# Altium schematic sheet Sheet1.SchDoc: Display
size B; Date: 10/02/2023; DrawnBy: NVK; SheetNumber: 1; SheetTotal: 1
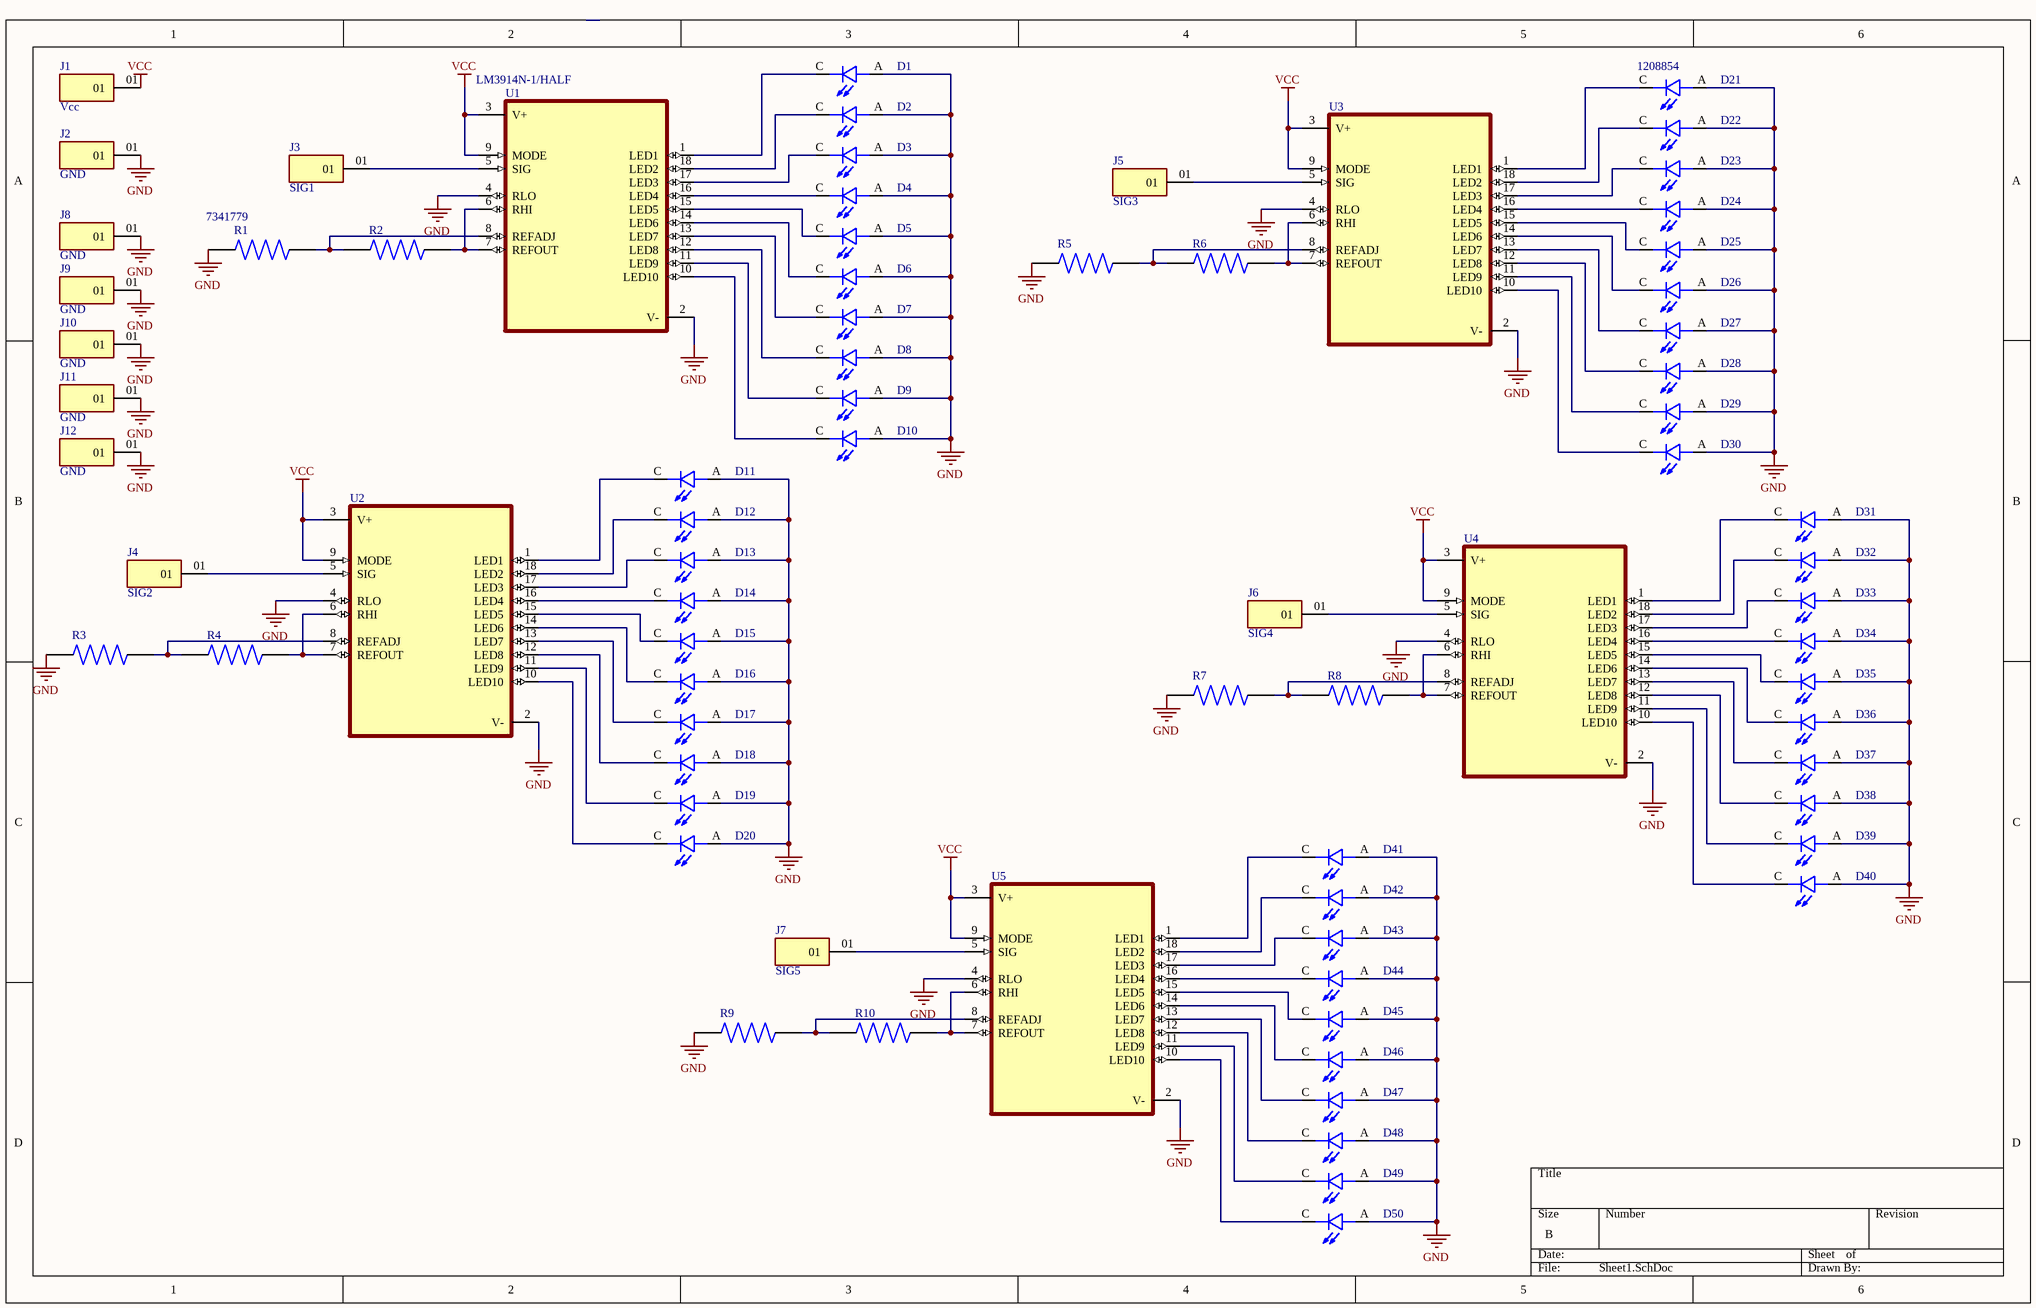
[diagram p0: Sheet1.SchDoc]

## Parts
D1  L08R5000Q1  [LEDRD254W57D500H1070]  (value not drawn)
D2  L08R5000Q1  [LEDRD254W57D500H1070]  (value not drawn)
D3  L08R5000Q1  [LEDRD254W57D500H1070]  (value not drawn)
D4  L08R5000Q1  [LEDRD254W57D500H1070]  (value not drawn)
D5  L08R5000Q1  [LEDRD254W57D500H1070]  (value not drawn)
D6  L08R5000Q1  [LEDRD254W57D500H1070]  (value not drawn)
D7  L08R5000Q1  [LEDRD254W57D500H1070]  (value not drawn)
D8  L08R5000Q1  [LEDRD254W57D500H1070]  (value not drawn)
D9  L08R5000Q1  [LEDRD254W57D500H1070]  (value not drawn)
D10  L08R5000Q1  [LEDRD254W57D500H1070]  (value not drawn)
D11  L08R5000Q1  [LEDRD254W57D500H1070]  (value not drawn)
D12  L08R5000Q1  [LEDRD254W57D500H1070]  (value not drawn)
D13  L08R5000Q1  [LEDRD254W57D500H1070]  (value not drawn)
D14  L08R5000Q1  [LEDRD254W57D500H1070]  (value not drawn)
D15  L08R5000Q1  [LEDRD254W57D500H1070]  (value not drawn)
D16  L08R5000Q1  [LEDRD254W57D500H1070]  (value not drawn)
D17  L08R5000Q1  [LEDRD254W57D500H1070]  (value not drawn)
D18  L08R5000Q1  [LEDRD254W57D500H1070]  (value not drawn)
D19  L08R5000Q1  [LEDRD254W57D500H1070]  (value not drawn)
D20  L08R5000Q1  [LEDRD254W57D500H1070]  (value not drawn)
D21  Supplier Part Number 1: 1208854  [LEDRD254W57D500H1070]  (hidden comment: L08R5000Q1)
D22  L08R5000Q1  [LEDRD254W57D500H1070]  (value not drawn)
D23  L08R5000Q1  [LEDRD254W57D500H1070]  (value not drawn)
D24  L08R5000Q1  [LEDRD254W57D500H1070]  (value not drawn)
D25  L08R5000Q1  [LEDRD254W57D500H1070]  (value not drawn)
D26  L08R5000Q1  [LEDRD254W57D500H1070]  (value not drawn)
D27  L08R5000Q1  [LEDRD254W57D500H1070]  (value not drawn)
D28  L08R5000Q1  [LEDRD254W57D500H1070]  (value not drawn)
D29  L08R5000Q1  [LEDRD254W57D500H1070]  (value not drawn)
D30  L08R5000Q1  [LEDRD254W57D500H1070]  (value not drawn)
D31  L08R5000Q1  [LEDRD254W57D500H1070]  (value not drawn)
D32  L08R5000Q1  [LEDRD254W57D500H1070]  (value not drawn)
D33  L08R5000Q1  [LEDRD254W57D500H1070]  (value not drawn)
D34  L08R5000Q1  [LEDRD254W57D500H1070]  (value not drawn)
D35  L08R5000Q1  [LEDRD254W57D500H1070]  (value not drawn)
D36  L08R5000Q1  [LEDRD254W57D500H1070]  (value not drawn)
D37  L08R5000Q1  [LEDRD254W57D500H1070]  (value not drawn)
D38  L08R5000Q1  [LEDRD254W57D500H1070]  (value not drawn)
D39  L08R5000Q1  [LEDRD254W57D500H1070]  (value not drawn)
D40  L08R5000Q1  [LEDRD254W57D500H1070]  (value not drawn)
D41  L08R5000Q1  [LEDRD254W57D500H1070]  (value not drawn)
D42  L08R5000Q1  [LEDRD254W57D500H1070]  (value not drawn)
D43  L08R5000Q1  [LEDRD254W57D500H1070]  (value not drawn)
D44  L08R5000Q1  [LEDRD254W57D500H1070]  (value not drawn)
D45  L08R5000Q1  [LEDRD254W57D500H1070]  (value not drawn)
D46  L08R5000Q1  [LEDRD254W57D500H1070]  (value not drawn)
D47  L08R5000Q1  [LEDRD254W57D500H1070]  (value not drawn)
D48  L08R5000Q1  [LEDRD254W57D500H1070]  (value not drawn)
D49  L08R5000Q1  [LEDRD254W57D500H1070]  (value not drawn)
D50  L08R5000Q1  [LEDRD254W57D500H1070]  (value not drawn)
J1  Vcc  [SAMTEC_MTMM-101-XX-X-S-XXX]
J2  GND  [SAMTEC_MTMM-101-XX-X-S-XXX]
J3  SIG1  [SAMTEC_MTMM-101-XX-X-S-XXX]
J4  SIG2  [SAMTEC_MTMM-101-XX-X-S-XXX]
J5  SIG3  [SAMTEC_MTMM-101-XX-X-S-XXX]
J6  SIG4  [SAMTEC_MTMM-101-XX-X-S-XXX]
J7  SIG5  [SAMTEC_MTMM-101-XX-X-S-XXX]
J8  GND  [SAMTEC_MTMM-101-XX-X-S-XXX]
J9  GND  [SAMTEC_MTMM-101-XX-X-S-XXX]
J10  GND  [SAMTEC_MTMM-101-XX-X-S-XXX]
J11  GND  [SAMTEC_MTMM-101-XX-X-S-XXX]
J12  GND  [SAMTEC_MTMM-101-XX-X-S-XXX]
R1  Supplier Part Number 1: 7341779  [RESAD1100W55L680D260]  (hidden comment: MFR-25FBF52-1K)
R2  MFR-25FBF52-1K  [RESAD1100W55L680D260]  (value not drawn)
R3  MFR-25FBF52-1K  [RESAD1100W55L680D260]  (value not drawn)
R4  MFR-25FBF52-1K  [RESAD1100W55L680D260]  (value not drawn)
R5  MFR-25FBF52-1K  [RESAD1100W55L680D260]  (value not drawn)
R6  MFR-25FBF52-1K  [RESAD1100W55L680D260]  (value not drawn)
R7  MFR-25FBF52-1K  [RESAD1100W55L680D260]  (value not drawn)
R8  MFR-25FBF52-1K  [RESAD1100W55L680D260]  (value not drawn)
R9  MFR-25FBF52-1K  [RESAD1100W55L680D260]  (value not drawn)
R10  MFR-25FBF52-1K  [RESAD1100W55L680D260]  (value not drawn)
U1  Supplier Part Number 1: LM3914N-1/HALF  [DIP952W45P254L2336H533Q18]  (hidden comment: LM3914N-1)
U2  LM3914N-1  [DIP952W45P254L2336H533Q18]  (value not drawn)
U3  LM3914N-1  [DIP952W45P254L2336H533Q18]  (value not drawn)
U4  LM3914N-1  [DIP952W45P254L2336H533Q18]  (value not drawn)
U5  LM3914N-1  [DIP952W45P254L2336H533Q18]  (value not drawn)

## Nets
GND: D1.A D2.A D3.A D4.A D5.A D6.A D7.A D8.A D9.A D10.A D11.A D12.A D13.A D14.A D15.A D16.A D17.A D18.A D19.A D20.A D21.A D22.A D23.A D24.A D25.A D26.A D27.A D28.A D29.A D30.A D31.A D32.A D33.A D34.A D35.A D36.A D37.A D38.A D39.A D40.A D41.A D42.A D43.A D44.A D45.A D46.A D47.A D48.A D49.A D50.A J2.01 J8.01 J9.01 J10.01 J11.01 J12.01 R1.1 R3.1 R5.1 R7.1 R9.1 U1.2(V-) U1.4(RLO) U2.2(V-) U2.4(RLO) U3.2(V-) U3.4(RLO) U4.2(V-) U4.4(RLO) U5.2(V-) U5.4(RLO)
VCC: J1.01 U1.3(V+) U1.9(MODE) U2.3(V+) U2.9(MODE) U3.3(V+) U3.9(MODE) U4.3(V+) U4.9(MODE) U5.3(V+) U5.9(MODE)
NetD1_C: D1.C U1.1(LED1)
NetD2_C: D2.C U1.18(LED2)
NetD3_C: D3.C U1.17(LED3)
NetD4_C: D4.C U1.16(LED4)
NetD5_C: D5.C U1.15(LED5)
NetD6_C: D6.C U1.14(LED6)
NetD7_C: D7.C U1.13(LED7)
NetD8_C: D8.C U1.12(LED8)
NetD9_C: D9.C U1.11(LED9)
NetD10_C: D10.C U1.10(LED10)
NetD11_C: D11.C U2.1(LED1)
NetD12_C: D12.C U2.18(LED2)
NetD13_C: D13.C U2.17(LED3)
NetD14_C: D14.C U2.16(LED4)
NetD15_C: D15.C U2.15(LED5)
NetD16_C: D16.C U2.14(LED6)
NetD17_C: D17.C U2.13(LED7)
NetD18_C: D18.C U2.12(LED8)
NetD19_C: D19.C U2.11(LED9)
NetD20_C: D20.C U2.10(LED10)
NetD21_C: D21.C U3.1(LED1)
NetD22_C: D22.C U3.18(LED2)
NetD23_C: D23.C U3.17(LED3)
NetD24_C: D24.C U3.16(LED4)
NetD25_C: D25.C U3.15(LED5)
NetD26_C: D26.C U3.14(LED6)
NetD27_C: D27.C U3.13(LED7)
NetD28_C: D28.C U3.12(LED8)
NetD29_C: D29.C U3.11(LED9)
NetD30_C: D30.C U3.10(LED10)
NetD31_C: D31.C U4.1(LED1)
NetD32_C: D32.C U4.18(LED2)
NetD33_C: D33.C U4.17(LED3)
NetD34_C: D34.C U4.16(LED4)
NetD35_C: D35.C U4.15(LED5)
NetD36_C: D36.C U4.14(LED6)
NetD37_C: D37.C U4.13(LED7)
NetD38_C: D38.C U4.12(LED8)
NetD39_C: D39.C U4.11(LED9)
NetD40_C: D40.C U4.10(LED10)
NetD41_C: D41.C U5.1(LED1)
NetD42_C: D42.C U5.18(LED2)
NetD43_C: D43.C U5.17(LED3)
NetD44_C: D44.C U5.16(LED4)
NetD45_C: D45.C U5.15(LED5)
NetD46_C: D46.C U5.14(LED6)
NetD47_C: D47.C U5.13(LED7)
NetD48_C: D48.C U5.12(LED8)
NetD49_C: D49.C U5.11(LED9)
NetD50_C: D50.C U5.10(LED10)
NetJ3_01: J3.01 U1.5(SIG)
NetJ4_01: J4.01 U2.5(SIG)
NetJ5_01: J5.01 U3.5(SIG)
NetJ6_01: J6.01 U4.5(SIG)
NetJ7_01: J7.01 U5.5(SIG)
NetR1_2: R1.2 R2.1 U1.8(REFADJ)
NetR2_2: R2.2 U1.6(RHI) U1.7(REFOUT)
NetR3_2: R3.2 R4.1 U2.8(REFADJ)
NetR4_2: R4.2 U2.6(RHI) U2.7(REFOUT)
NetR5_2: R5.2 R6.1 U3.8(REFADJ)
NetR6_2: R6.2 U3.6(RHI) U3.7(REFOUT)
NetR7_2: R7.2 R8.1 U4.8(REFADJ)
NetR8_2: R8.2 U4.6(RHI) U4.7(REFOUT)
NetR9_2: R9.2 R10.1 U5.8(REFADJ)
NetR10_2: R10.2 U5.6(RHI) U5.7(REFOUT)

## Library data of the parts
D1-D50 = L08R5000Q1: LED, Orange, Through Hole, T-1 3/4 (5mm), 30 mA, 2.1 V, 635 nm; Price: None; MP: L08R5000Q1; Value: *; Availability: Unavailable; Package: None
  D21: Supplier 1: Farnell
J1-J12 = MTMM-101-XX-X-S-XXX: Connector Header position; Package: None; MP: MTMM-101-XX-X-S-XXX; Value: *; Availability: Unavailable; Price: None
R1-R10 = MFR-25FBF52-1K: 1.78 kOhms Â±1% 0.25W, 1/4W Through Hole Resistor Axial - Metal Film; MF: Yageo; Package: Axial Yageo; Check_prices: https://www.snapeda.com/parts/MFR-25FBF52-1K/Yageo/view-part/?ref=eda; Availability: In Stock; MP: MFR-25FBF52-1K; Value: *; Purchase-URL: https://pricing.snapeda.com/search/part/MFR-25FBF52-1K/?ref=eda; SnapEDA_Link: https://www.snapeda.com/parts/MFR-25FBF52-1K/Yageo/view-part/?ref=snap
  R1: Supplier 1: Future Electronics
  R2-R10: Price: None
U1-U5 = LM3914N-1: None <a href="https://snapeda.com/parts/LM3914N-1/Texas%20Instruments/view-part/?ref=eda">Check prices</a>; Package: None; Availability: Unavailable; Price: None; Value: *; MP: LM3914N-1
  U1: Supplier 1: Arrow Electronics